# EAGLE design LACE_mod_con_prog (EAGLE 5.07)
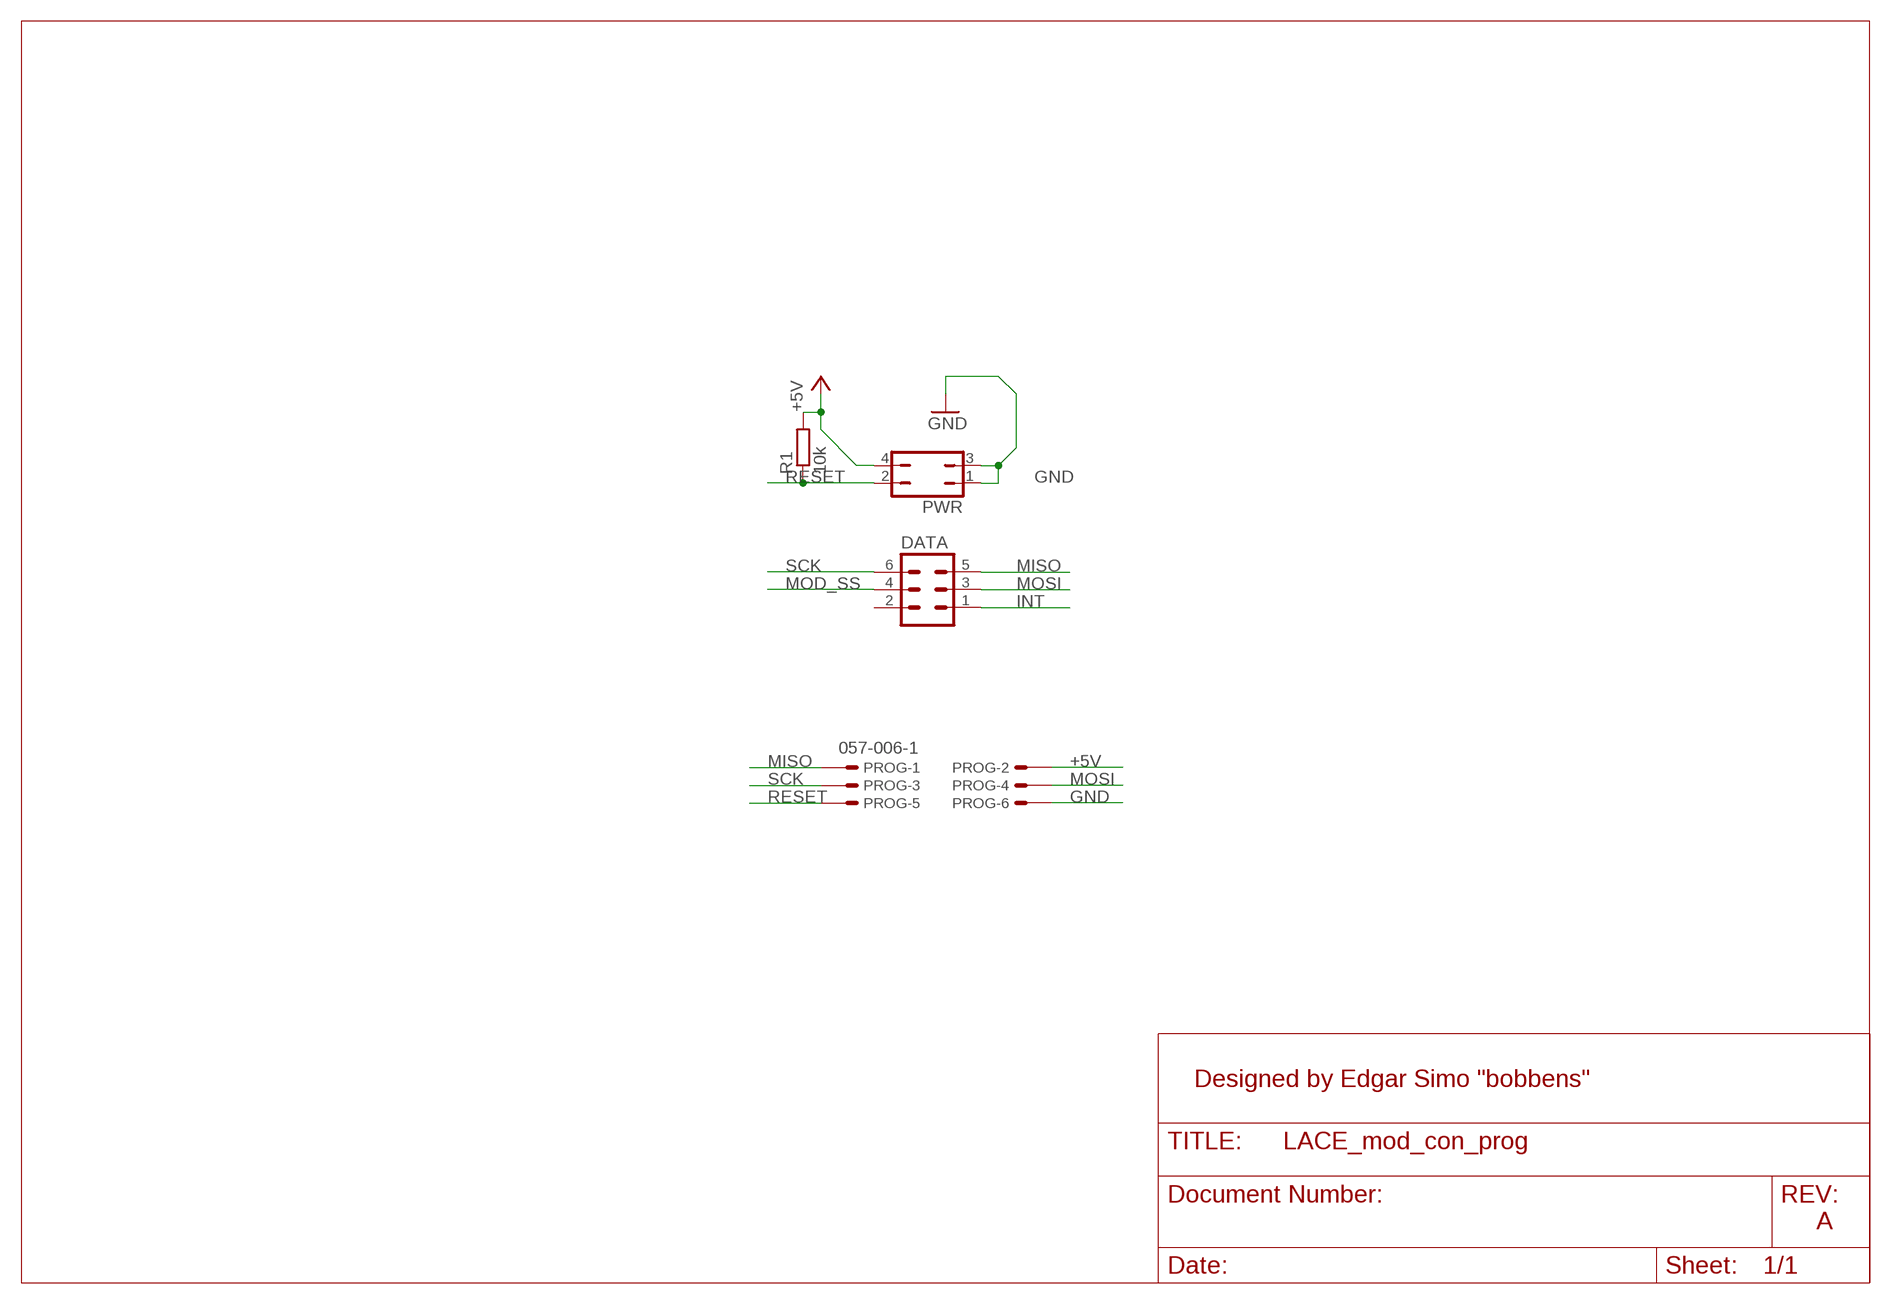
[diagram p0: schematic, sheet 1]

## Parts
DATA  MA03-2  [MA03-2]
PROG  057-006-1  [057-006-1]
PWR  JP2Q  [JP2Q]
R1  10k  R-EU_R0805  [R0805]

## Nets
+5V: PROG.2 PWR.4 R1.2
GND: PROG.6 PWR.1 PWR.3
INT: DATA.1
MISO: DATA.5 PROG.1
MOD_SS: DATA.4
MOSI: DATA.3 PROG.4
RESET: PROG.5 PWR.2 R1.1
SCK: DATA.6 PROG.3
Unconnected: DATA.2

## Notes on the sheet
- Designed by Edgar Simo "bobbens"
- A

## Library data of the parts
DATA = con-lstb:MA03-2: PIN HEADER
PROG = con-panduit:057-006-: CONNECTOR 6-pin series 057 contact pc board low profile headers
PWR = jumper:JP2Q: JUMPER
R1 = rcl:R-EU_: RESISTOR, European symbol

## Board
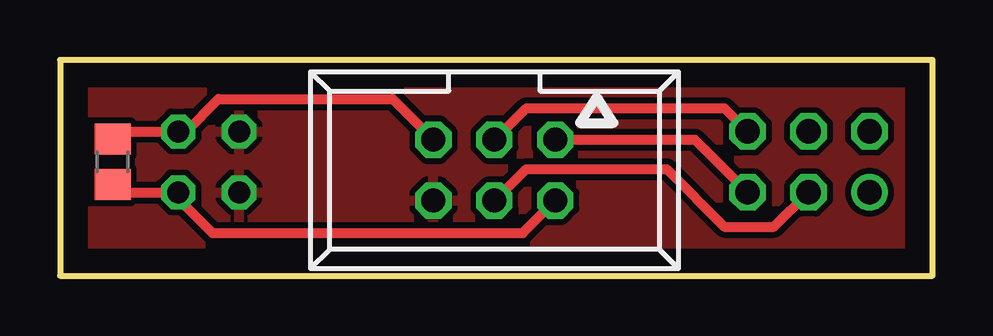
[diagram p1: board, top side]
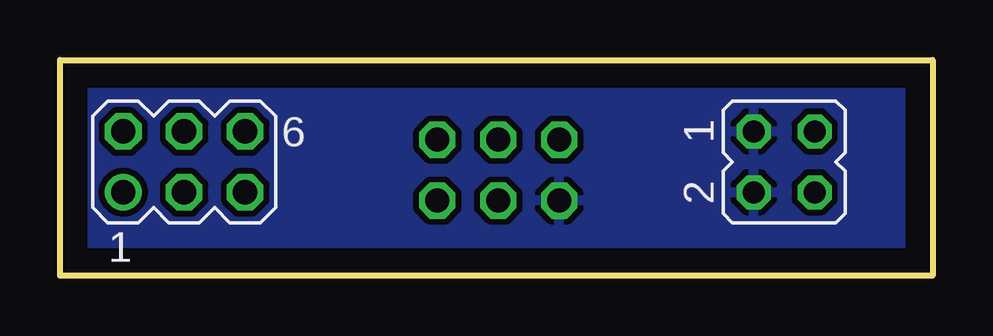
[diagram p2: board, bottom side, seen from below]

Size 36.36 x 9 mm. Coordinates in mm from the lower left corner, seen from the top.
Outline: 0,0 36.36,0 36.36,9 0,9 0,0
Copper layers (1*16): Top 0.035mm / dielectric 1.5mm / Bottom 0.035mm
Design rules "10mils": minimum track width 10mil, minimum drill 24mil, track to track 10mil, track to pad 10mil, pad to pad 10mil, via to via 10mil, smd to smd 10mil, copper to edge 40mil, drill to drill 10mil, minimum pad ring 10mil, minimum via ring 8mil, stop-mask expansion 0mil, vias tented up to drill 0mil, thermal gap 10mil

### Footprints (pad centres in the part's own frame; a part is rotated, then mirrored left to right if it is on the bottom)
MA03-2 = drill 1.016 round: 1 -2.54,-1.27 | drill 1.016 octagon: 2 -2.54,1.27; 3 0,-1.27; 4 0,1.27; 5 2.54,-1.27; 6 2.54,1.27
057-006-1 = drill 1 octagon: 1 -2.54,-1.27; 2 -2.54,1.27; 3 0,-1.27; 4 0,1.27; 5 2.54,-1.27; 6 2.54,1.27
JP2Q = drill 0.914 octagon: 1 -1.27,-1.27; 2 -1.27,1.27; 3 1.27,-1.27; 4 1.27,1.27
R0805 = smd 1.3 x 1.5: 1 -0.95,0; 2 0.95,0

### Placement (x,y rotation side)
DATA  31.19,4.75 0 bottom
PROG  18.1,4.4 180 top
PWR  6.19,4.75 270 bottom
R1  2.19,4.75 270 top

### Tracks (layer width: path | path; a pad name or v marks a point on that pad's centre or on a via)
+5V
  Top 0.406: R1.2 2.51,3.48 PWR.4 4.92,3.21 6.35,1.78 19.29,1.78 PROG.2
GND
  pour Bottom (isolate 0.254): -0.51,-0.25 -0.51,9.4 36.58,9.4 36.58,-0.51
  pour Top (isolate 0.254): 0.25,0.51 0.25,8.64 36.07,8.64 36.07,0.25
MISO
  Top 0.406: PROG.1 26.46,5.67 DATA.5
MOSI
  Top 0.406: PROG.4 18.11,3.13 19.43,4.45 25.27,4.45 27.69,2.03 29.75,2.03 DATA.3
RESET
  Top 0.406: R1.1 2.51,6.02 PWR.2 5.25,6.02 6.6,7.37 13.86,7.37 PROG.5
SCK
  Top 0.406: PROG.3 18.11,5.67 19.43,6.99 27.68,6.99 DATA.6